# Altium schematic sheet Sheet2.SchDoc
size B
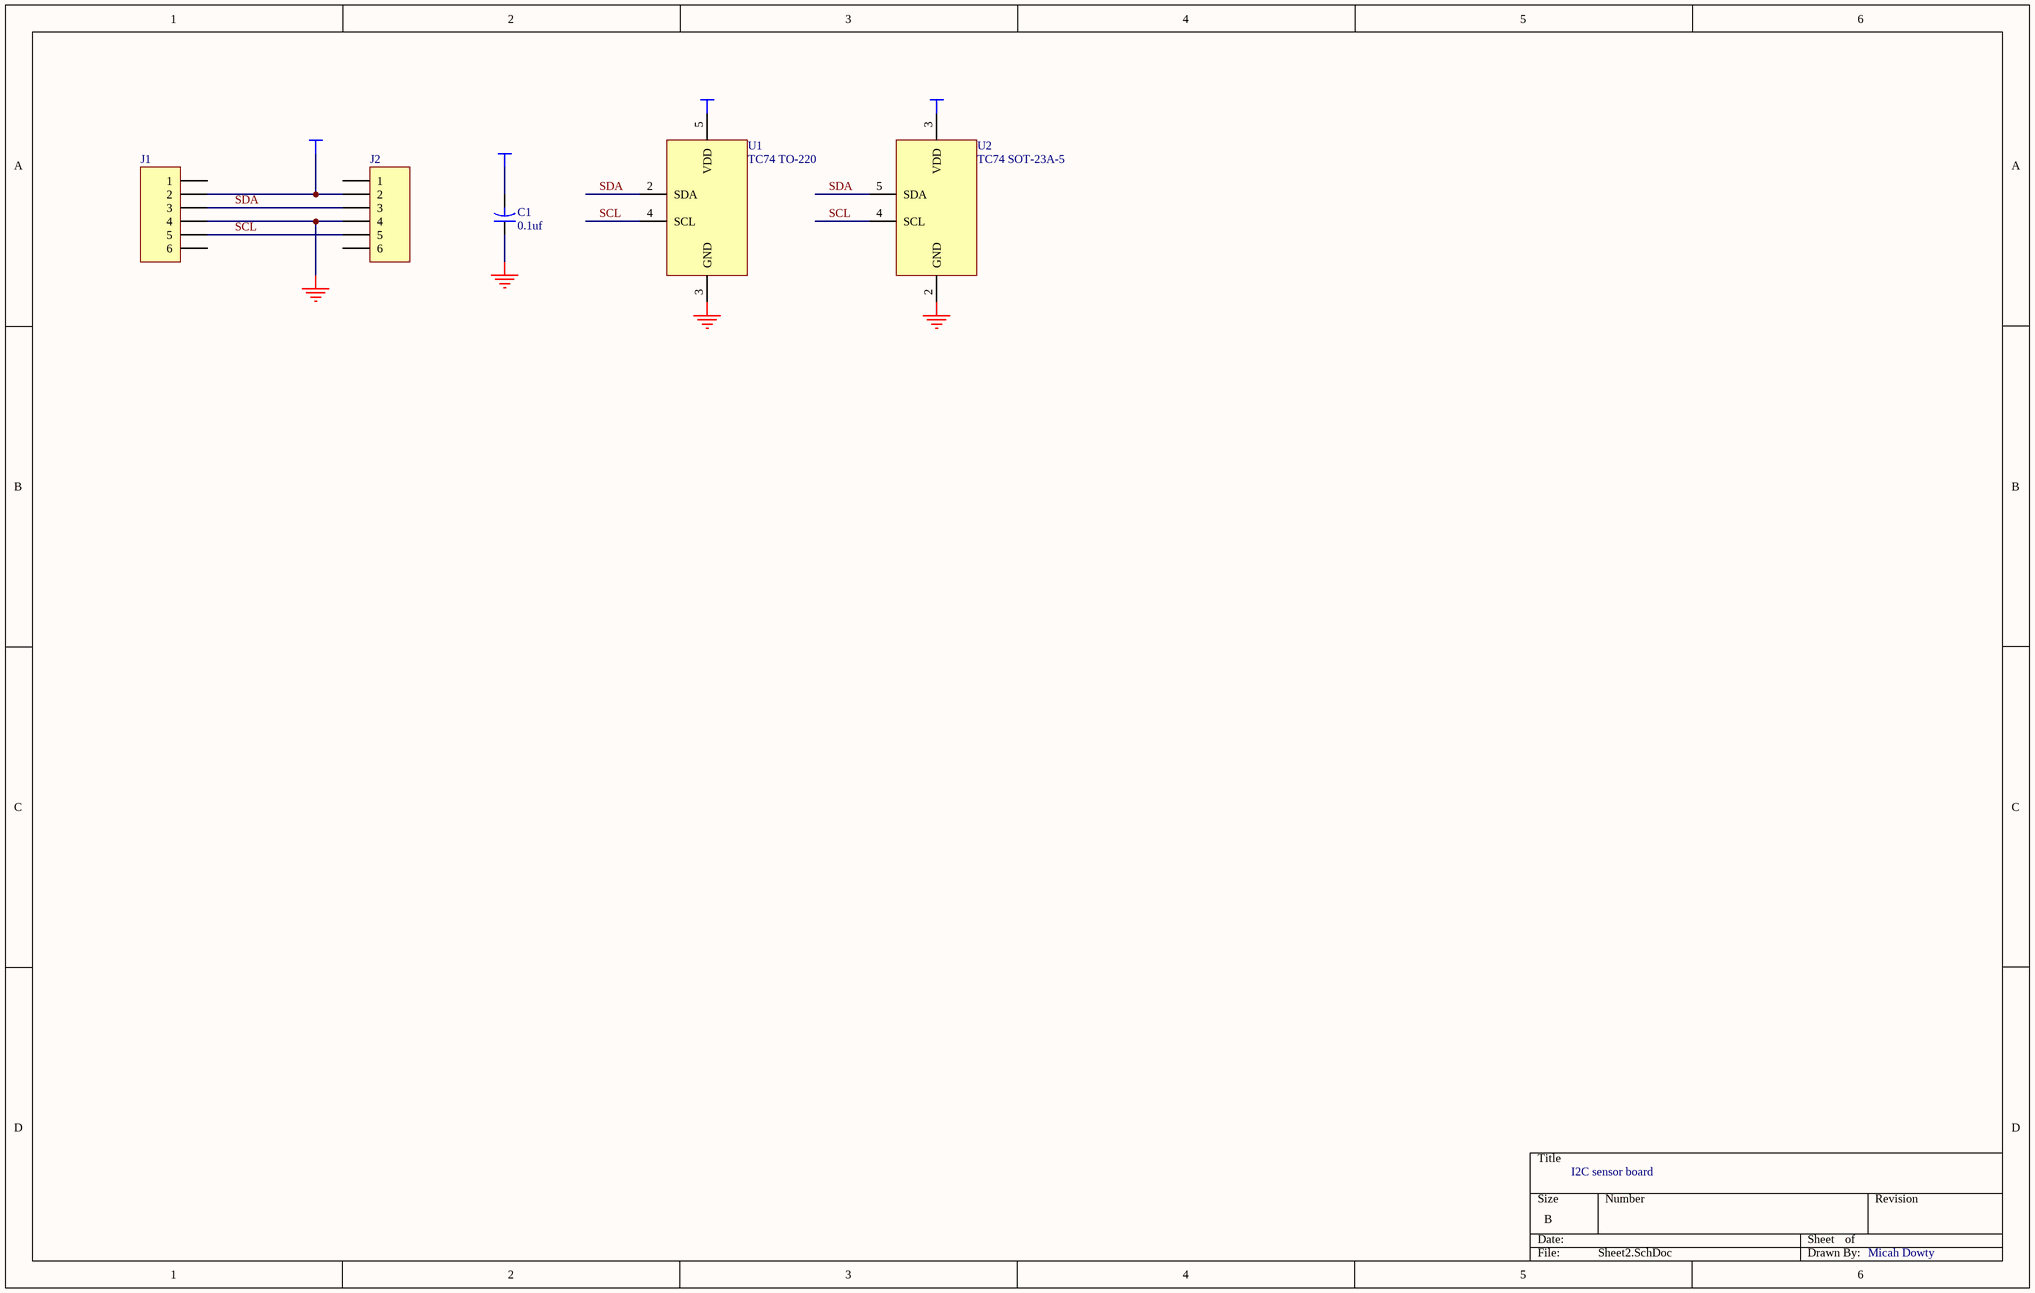
[diagram p0: Sheet2.SchDoc]

## Parts
C1  value 0.1uf  [CAPR5-4X5]
J1  (no value)  [RJ11]
J2  (no value)  [RJ11]
U1  TC74 TO-220  [SFM-T5/A4.6V-NOTEXT]
U2  TC74 SOT-23A-5  [SO-G5/Z3.6]

## Nets
GND: C1.1 J1.4 J2.4 U1.3(GND) U2.2(GND)
VCC: C1.2 J1.2 J2.2 U1.5(VDD) U2.3(VDD)
SCL: J1.5 J2.5 U1.4(SCL) U2.4(SCL)
SDA: J1.3 J2.3 U1.2(SDA) U2.5(SDA)

Not connected (* = marked no-connect by the designer): J1 1 6; J2 1 6

## Notes on the sheet
- I2C sensor board
- Micah Dowty

## Library data of the parts
C1 = Cap2: Capacitor; Manufacturer: Generic Components; Class I: Passive; Published: 23-Sep-2002; Publisher: Altium Limited; Class II: Capacitor
J1 J2 = Header 6: Header, 6-Pin; Manufacturer: Generic Components; Class I: Connector; Revision: July-2002: Re-released for DXP Platform.; Publisher: Altium Limited